# Altium schematic sheet S7CAS-PLEIADES-CARTE-MERE_Pxx_CAN.SchDoc
size Tabloid; SheetNumber: 12; SheetTotal: 18; Sheet_Name: CAN; Size: 11x17
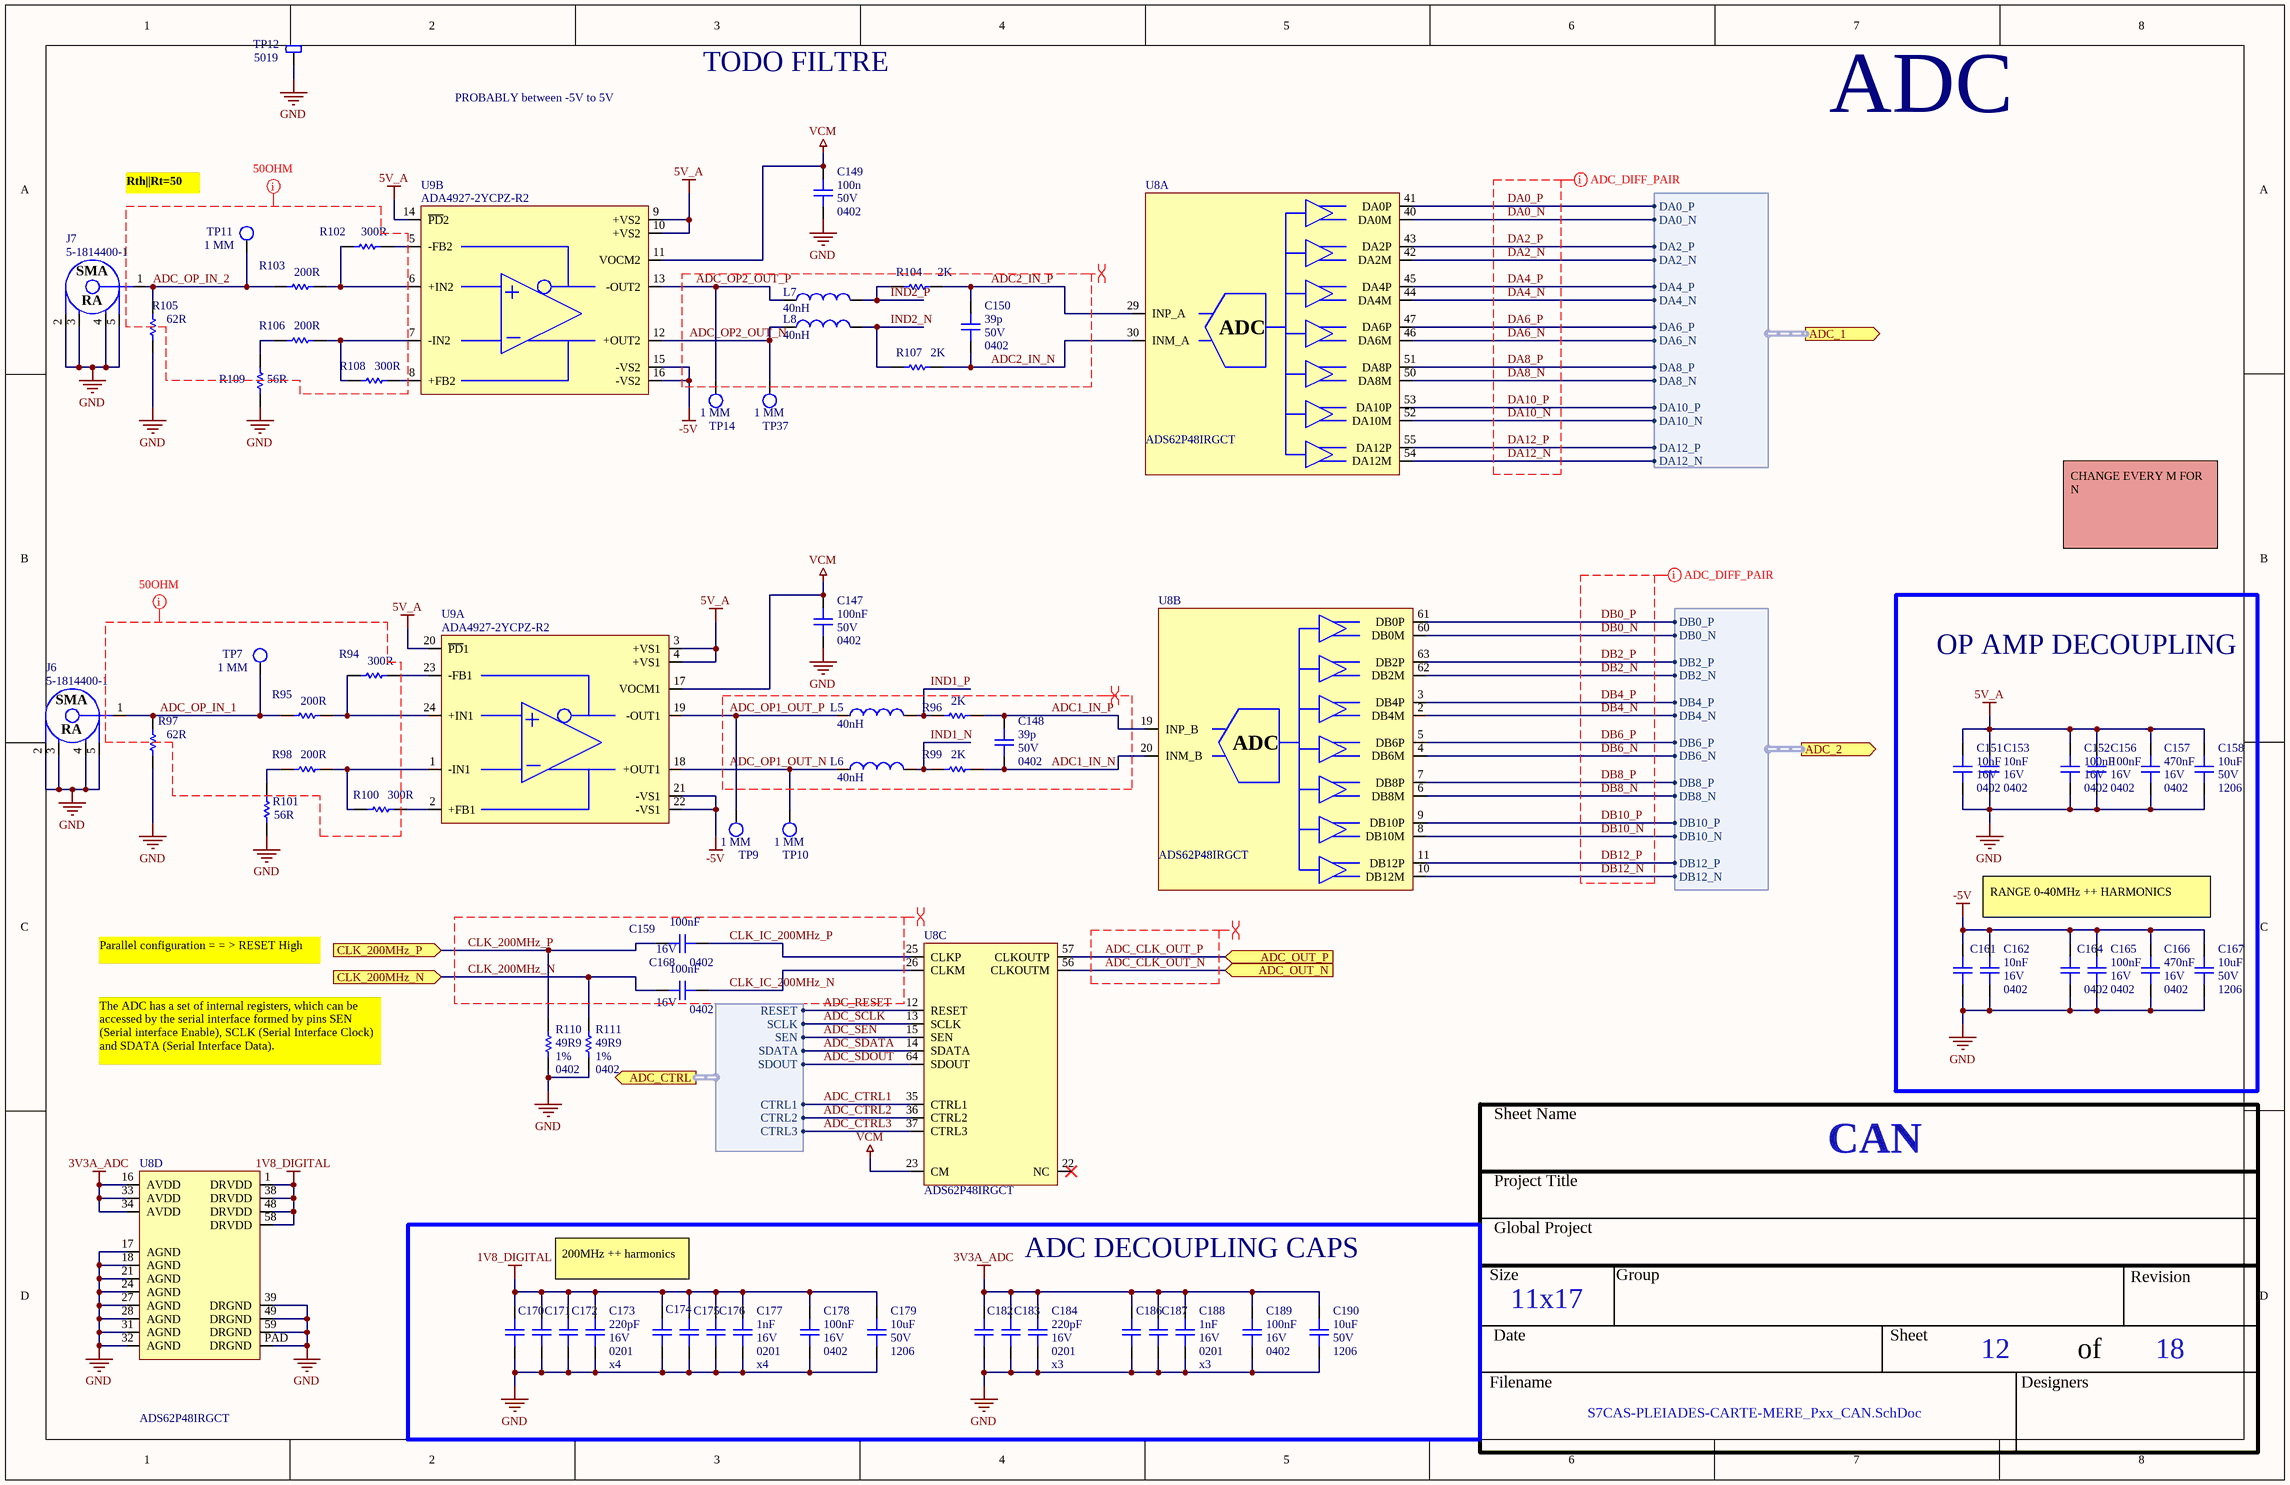
[diagram p0: S7CAS-PLEIADES-CARTE-MERE_Pxx_CAN.SchDoc]

## Parts
C147  value 100nF  Voltage: 50V  [CAP_0402]  (hidden comment: 0402)
C148  value 39p  Voltage: 50V  [CAP_0402]  (hidden comment: 0402)
C149  value 100n  Voltage: 50V  [CAP_0402]  (hidden comment: 0402)
C150  value 39p  Voltage: 50V  [CAP_0402]  (hidden comment: 0402)
C151  value 10nF  Voltage: 16V  Package: 0402  [CAP_0402]  (hidden comment: CAP - 0402)
C152  value 100nF  Voltage: 16V  [CAP_0402]  (hidden comment: 0402)
C153  value 10nF  Voltage: 16V  Package: 0402  [CAP_0402]  (hidden comment: CAP - 0402)
C156  value 100nF  Voltage: 16V  [CAP_0402]  (hidden comment: 0402)
C157  value 470nF  Voltage: 16V  [CAP_0402]  (hidden comment: 0402)
C158  value 10uF  Voltage: 50V  Package: 1206  [CAP_1206]  (hidden comment: CAP - 1206)
C159  value 100nF  Voltage: 16V  [CAP_0402]  (hidden comment: 0402)
C161  CAP - 0402  [CAP_0402]  (value not drawn)
C162  value 10nF  Voltage: 16V  Package: 0402  [CAP_0402]  (hidden comment: CAP - 0402)
C164  0402  [CAP_0402]
C165  value 100nF  Voltage: 16V  [CAP_0402]  (hidden comment: 0402)
C166  value 470nF  Voltage: 16V  [CAP_0402]  (hidden comment: 0402)
C167  value 10uF  Voltage: 50V  Package: 1206  [CAP_1206]  (hidden comment: CAP - 1206)
C168  value 100nF  Voltage: 16V  [CAP_0402]  (hidden comment: 0402)
C170  CAP - 0201  [CAP_0201]  (value not drawn)
C171  CAP - 0201  [CAP_0201]  (value not drawn)
C172  CAP - 0201  [CAP_0201]  (value not drawn)
C173  value 220pF  Voltage: 16V  Package: 0201  [CAP_0201]  (hidden comment: CAP - 0201)
C174  CAP - 0201  [CAP_0201]  (value not drawn)
C175  CAP - 0201  [CAP_0201]  (value not drawn)
C176  CAP - 0201  [CAP_0201]  (value not drawn)
C177  value 1nF  Voltage: 16V  Package: 0201  [CAP_0201]  (hidden comment: CAP - 0201)
C178  value 100nF  Voltage: 16V  [CAP_0402]  (hidden comment: 0402)
C179  value 10uF  Voltage: 50V  Package: 1206  [CAP_1206]  (hidden comment: CAP - 1206)
C182  CAP - 0201  [CAP_0201]  (value not drawn)
C183  CAP - 0201  [CAP_0201]  (value not drawn)
C184  value 220pF  Voltage: 16V  Package: 0201  [CAP_0201]  (hidden comment: CAP - 0201)
C186  CAP - 0201  [CAP_0201]  (value not drawn)
C187  CAP - 0201  [CAP_0201]  (value not drawn)
C188  value 1nF  Voltage: 16V  Package: 0201  [CAP_0201]  (hidden comment: CAP - 0201)
C189  value 100nF  Voltage: 16V  [CAP_0402]  (hidden comment: 0402)
C190  value 10uF  Voltage: 50V  Package: 1206  [CAP_1206]  (hidden comment: CAP - 1206)
J6  5-1814400-1  [CONN_SMA_5-1814400-1]
J7  5-1814400-1  [CONN_SMA_5-1814400-1]
L5  value 40nH  [IND - 0402]  (hidden comment: INDUCTOR - 0402)
L6  value 40nH  [IND - 0402]  (hidden comment: INDUCTOR - 0402)
L7  value 40nH  [IND - 0402]  (hidden comment: INDUCTOR - 0402)
L8  value 40nH  [IND - 0402]  (hidden comment: INDUCTOR - 0402)
R94  value 300R  [RES_0402]  (hidden comment: RES - 0603)
R95  value 200R  [RES_0402]  (hidden comment: RES - 0603)
R96  value 2K  [RES_0402]  (hidden comment: RES - 0603)
R97  value 62R  [RES_0402]  (hidden comment: RES - 0603)
R98  value 200R  [RES_0402]  (hidden comment: RES - 0603)
R99  value 2K  [RES_0402]  (hidden comment: RES - 0603)
R100  value 300R  [RES_0402]  (hidden comment: RES - 0603)
R101  value 56R  [RES_0402]  (hidden comment: RES - 0603)
R102  value 300R  [RES_0402]  (hidden comment: RES - 0603)
R103  value 200R  [RES_0402]  (hidden comment: RES - 0603)
R104  value 2K  [RES_0402]  (hidden comment: RES - 0603)
R105  value 62R  [RES_0402]  (hidden comment: RES - 0603)
R106  value 200R  [RES_0402]  (hidden comment: RES - 0603)
R107  value 2K  [RES_0402]  (hidden comment: RES - 0603)
R108  value 300R  [RES_0402]  (hidden comment: RES - 0603)
R109  value 56R  [RES_0402]  (hidden comment: RES - 0603)
R110  value 49R9  Package: 0402  Precision: 1%  [RES_0402]  (hidden comment: RES - 0603)
R111  value 49R9  Package: 0402  Precision: 1%  [RES_0402]  (hidden comment: RES - 0603)
TP7  1 MM  [TPO_SMD_ROUND_1MM]  (no BOM)
TP9  1 MM  [TPO_SMD_ROUND_1MM]  (no BOM)
TP10  1 MM  [TPO_SMD_ROUND_1MM]  (no BOM)
TP11  1 MM  [TPO_SMD_ROUND_1MM]  (no BOM)
TP12  5019  [TPO_SMD_5019]
TP14  1 MM  [TPO_SMD_ROUND_1MM]  (no BOM)
TP37  1 MM  [TPO_SMD_ROUND_1MM]  (no BOM)
U8  ADS62P48IRGCT  [ADC_ADS62P48IRGCT]  (parts A,B,C,D of 4)
U9  ADA4927-2YCPZ-R2  [OPAMP_ADA4927-2YCPZ-R2]  (parts A,B of 2)

## Blocks framed on the sheet
OP AMP DECOUPLING: C151-C153 C156-C158 C161 C162 C164-C167
ADC DECOUPLING CAPS: C170-C179 C182-C184 C186-C190

## Ports
ADC_1 (out, harness ADC_1_HARNESS, see S7CAS-PLEIADES-CARTE-MERE_Pxx_FPGA_bank3[1A]), ADC_2 (out, harness ADC_2_HARNESS, see S7CAS-PLEIADES-CARTE-MERE_Pxx_FPGA_bank3[1B]), ADC_CTRL (out, harness ADC_CTRL_HARNESS, see S7CAS-PLEIADES-CARTE-MERE_Pxx_FPGA_bank3[2C]), ADC_OUT_N (in, see S7CAS-PLEIADES-CARTE-MERE_Pxx_FPGA_bank3[5B]), ADC_OUT_P (in, see S7CAS-PLEIADES-CARTE-MERE_Pxx_FPGA_bank3[5B]), CLK_200MHz_N (in, see S7CAS-PLEIADES-CARTE-MERE_Pxx_FLASH_PHY_CLOCK[5A]), CLK_200MHz_P (in, see S7CAS-PLEIADES-CARTE-MERE_Pxx_FLASH_PHY_CLOCK[5A])

## Harnesses
ADC_1_HARNESS: DA0_P, DA0_N, DA2_P, DA2_N, DA4_P, DA4_N, DA6_P, DA6_N, DA8_P, DA8_N, DA10_P, DA10_N, DA12_P, DA12_N
ADC_2_HARNESS: DB0_P, DB0_N, DB2_P, DB2_N, DB4_P, DB4_N, DB6_P, DB6_N, DB8_P, DB8_N, DB10_P, DB10_N, DB12_P, DB12_N
ADC_CTRL_HARNESS: RESET, SCLK, SEN, SDATA, SDOUT, CTRL1, CTRL2, CTRL3

## Nets
1V8_DIGITAL: C170.2 C171.2 C172.2 C173.2 C174.2 C175.2 C176.2 C177.2 C178.2 C179.2 U8.1(DRVDD) U8.38(DRVDD) U8.48(DRVDD) U8.58(DRVDD)
3V3A_ADC: C182.2 C183.2 C184.2 C186.2 C187.2 C188.2 C189.2 C190.2 U8.16(AVDD) U8.33(AVDD) U8.34(AVDD)
5V_A: C151.2 C152.2 C153.2 C156.2 C157.2 C158.2 U9.3(+VS1) U9.4(+VS1) U9.9(+VS2) U9.10(+VS2) U9.14(~{PD}2) U9.20(~{PD}1)
-5V: C161.2 C162.2 C164.2 C165.2 C166.2 C167.2 U9.15(-VS2) U9.16(-VS2) U9.21(-VS1) U9.22(-VS1)
GND: C147.1 C149.1 C151.1 C152.1 C153.1 C156.1 C157.1 C158.1 C161.1 C162.1 C164.1 C165.1 C166.1 C167.1 C170.1 C171.1 C172.1 C173.1 C174.1 C175.1 C176.1 C177.1 C178.1 C179.1 C182.1 C183.1 C184.1 C186.1 C187.1 C188.1 C189.1 C190.1 J6.2 J6.3 J6.4 J6.5 J7.2 J7.3 J7.4 J7.5 R97.1 R101.2 R105.1 R109.2 R110.1 R111.1 TP12.1 U8.17(AGND) U8.18(AGND) U8.21(AGND) U8.24(AGND) U8.27(AGND) U8.28(AGND) U8.31(AGND) U8.32(AGND) U8.39(DRGND) U8.49(DRGND) U8.59(DRGND) U8.PAD(DRGND)
VCM: C147.2 C149.2 U8.23(CM) U9.11(VOCM2) U9.17(VOCM1)
ADC1_IN_N: C148.1 R99.1 U8.20(INM_B)
ADC1_IN_P: C148.2 R96.1 U8.19(INP_B)
ADC2_IN_N: C150.1 R107.1 U8.30(INM_A)
ADC2_IN_P: C150.2 R104.1 U8.29(INP_A)
ADC_CLK_OUT_N: U8.56(CLKOUTM) ; port ADC_OUT_N
ADC_CLK_OUT_P: U8.57(CLKOUTP) ; port ADC_OUT_P
ADC_CTRL1: U8.35(CTRL1) ; port ADC_CTRL.CTRL1
ADC_CTRL2: U8.36(CTRL2) ; port ADC_CTRL.CTRL2
ADC_CTRL3: U8.37(CTRL3) ; port ADC_CTRL.CTRL3
ADC_OP1_OUT_N: L6.1 TP10.1 U9.18(+OUT1)
ADC_OP1_OUT_P: L5.1 TP9.1 U9.19(-OUT1)
ADC_OP2_OUT_N: L8.1 TP37.1 U9.12(+OUT2)
ADC_OP2_OUT_P: L7.1 TP14.1 U9.13(-OUT2)
ADC_OP_IN_1: J6.1 R95.2 R97.2 TP7.1
ADC_OP_IN_2: J7.1 R103.2 R105.2 TP11.1
ADC_RESET: U8.12(RESET) ; port ADC_CTRL.RESET
ADC_SCLK: U8.13(SCLK) ; port ADC_CTRL.SCLK
ADC_SDATA: U8.14(SDATA) ; port ADC_CTRL.SDATA
ADC_SDOUT: U8.64(SDOUT) ; port ADC_CTRL.SDOUT
ADC_SEN: U8.15(SEN) ; port ADC_CTRL.SEN
CLK_200MHz_N: C168.2 R111.2 ; port CLK_200MHz_N
CLK_200MHz_P: C159.2 R110.2 ; port CLK_200MHz_P
CLK_IC_200MHz_N: C168.1 U8.26(CLKM)
CLK_IC_200MHz_P: C159.1 U8.25(CLKP)
DA0_N: U8.40(DA0M) ; port ADC_1.DA0_N
DA0_P: U8.41(DA0P) ; port ADC_1.DA0_P
DA2_N: U8.42(DA2M) ; port ADC_1.DA2_N
DA2_P: U8.43(DA2P) ; port ADC_1.DA2_P
DA4_N: U8.44(DA4M) ; port ADC_1.DA4_N
DA4_P: U8.45(DA4P) ; port ADC_1.DA4_P
DA6_N: U8.46(DA6M) ; port ADC_1.DA6_N
DA6_P: U8.47(DA6P) ; port ADC_1.DA6_P
DA8_N: U8.50(DA8M) ; port ADC_1.DA8_N
DA8_P: U8.51(DA8P) ; port ADC_1.DA8_P
DA10_N: U8.52(DA10M) ; port ADC_1.DA10_N
DA10_P: U8.53(DA10P) ; port ADC_1.DA10_P
DA12_N: U8.54(DA12M) ; port ADC_1.DA12_N
DA12_P: U8.55(DA12P) ; port ADC_1.DA12_P
DB0_N: U8.60(DB0M) ; port ADC_2.DB0_N
DB0_P: U8.61(DB0P) ; port ADC_2.DB0_P
DB2_N: U8.62(DB2M) ; port ADC_2.DB2_N
DB2_P: U8.63(DB2P) ; port ADC_2.DB2_P
DB4_N: U8.2(DB4M) ; port ADC_2.DB4_N
DB4_P: U8.3(DB4P) ; port ADC_2.DB4_P
DB6_N: U8.4(DB6M) ; port ADC_2.DB6_N
DB6_P: U8.5(DB6P) ; port ADC_2.DB6_P
DB8_N: U8.6(DB8M) ; port ADC_2.DB8_N
DB8_P: U8.7(DB8P) ; port ADC_2.DB8_P
DB10_N: U8.8(DB10M) ; port ADC_2.DB10_N
DB10_P: U8.9(DB10P) ; port ADC_2.DB10_P
DB12_N: U8.10(DB12M) ; port ADC_2.DB12_N
DB12_P: U8.11(DB12P) ; port ADC_2.DB12_P
IND1_N: L6.2 R99.2
IND1_P: L5.2 R96.2
IND2_N: L8.2 R107.2
IND2_P: L7.2 R104.2
NetR94_1: R94.1 U9.23(-FB1)
NetR94_2: R94.2 R95.1 U9.24(+IN1)
NetR98_1: R98.1 R100.2 U9.1(-IN1)
NetR98_2: R98.2 R101.1
NetR100_1: R100.1 U9.2(+FB1)
NetR102_1: R102.1 U9.5(-FB2)
NetR102_2: R102.2 R103.1 U9.6(+IN2)
NetR106_1: R106.1 R108.2 U9.7(-IN2)
NetR106_2: R106.2 R109.1
NetR108_1: R108.1 U9.8(+FB2)

Not connected (* = marked no-connect by the designer): U8 22(NC)*

## Layout directives
differential pair; differential pair class ADC_DATA_OUT; differential pair class LVDS: DA0_N, DA0_P, DA2_N, DA2_P, DA4_N, DA4_P, DA6_N, DA6_P, DA8_N, DA8_P, DA10_N, DA10_P, DA12_N, DA12_P, DB0_N, DB0_P, DB2_N, DB2_P, DB4_N, DB4_P, DB6_N, DB6_P, DB8_N, DB8_P, DB10_N, DB10_P, DB12_N, DB12_P
differential pair; differential pair class CLK_200MHz; differential pair class LVDS: CLK_200MHz_N, CLK_200MHz_P, CLK_IC_200MHz_N, CLK_IC_200MHz_P
differential pair; differential pair class ADC_REF_CLOCK; differential pair class LVDS: ADC_CLK_OUT_N, ADC_CLK_OUT_P
differential pair; differential pair class OP_AMP_DIFF_CLASS; differential pair class 100OHMDIFF: ADC1_IN_N, ADC1_IN_P, ADC2_IN_N, ADC2_IN_P, ADC_OP1_OUT_N, ADC_OP1_OUT_P, ADC_OP2_OUT_N, ADC_OP2_OUT_P, IND1_N, IND2_N, IND2_P
net class 50OHM: ADC_OP_IN_1, ADC_OP_IN_2

## Notes on the sheet
- TODO FILTRE
- PROBABLY between -5V to 5V
- ADC
- Rth||Rt=50
- CHANGE EVERY M FOR N
- Parallel configuration = = > RESET High
- RANGE 0-40MHz ++ HARMONICS
- The ADC has a set of internal registers, which can be accessed by the serial interface formed by pins SEN
  (Serial interface Enable), SCLK (Serial Interface Clock) and SDATA (Serial Interface Data).
- 200MHz ++ harmonics
- (near C173) x4
- (near C177) x4
- (near C184) x3
- (near C188) x3
- Sheet Name
- Project Title
- Global Project
- Size
- Group
- Revision
- Date
- Sheet
- of
- Filename
- Designers
- (in symbol ADC_ADS62P48IRGCT, part A) ADC
- (in symbol ADC_ADS62P48IRGCT, part B) ADC
- (in symbol CONN_SMA_5-1814400-1) SMA; RA

## Library data of the parts
C147-C150 C152 C156 C157 C159 C165 C166 C168 C178 C189 = CAP - 0603: CAP - 0402; Precision: 10%; Current: *; CreatedBy: Jonathan Bouchard; Power: *; Package: 0402
  C152 C156 C159 C165 C168 C178 C189: Supplier 1: Arrow Electronics; Supplier Part Number 1: CL10B104KO8NNNC
  C157 C166: Supplier 1: Arrow Electronics; Supplier Part Number 1: C1608X7R1C474K080AC
C151 C153 C162 = CAP - 0402: Precision: 10%; Current: *; CreatedBy: Jonathan Bouchard; Power: *; Supplier 1: Arrow Electronics; Supplier Part Number 1: GRM155R61A224KE19D
C158 C167 C179 C190 = CAP - 1206: Precision: 10%; Current: *; CreatedBy: Jonathan Bouchard; Power: *; Supplier 1: Avnet; Supplier Part Number 1: CL31A106MBHNNNE
C161 = CAP - 0402: Precision: 10%; Voltage: 16V; Value: 10nF; Current: *; CreatedBy: Jonathan Bouchard; Power: *; Package: 0402; Supplier 1: Arrow Electronics; Supplier Part Number 1: GRM155R61A224KE19D
C164 = CAP - 0603: CAP - 0402; Precision: 10%; Voltage: 16V; Value: 100nF; Current: *; CreatedBy: Jonathan Bouchard; Power: *; Package: 0402; Supplier 1: Arrow Electronics; Supplier Part Number 1: CL10B104KO8NNNC
C170-C172 C182 C183 = CAP - 0201: Precision: 10%; Voltage: 16V; Value: 220pF; Current: *; CreatedBy: Jonathan Bouchard; Power: *; Package: 0201; Supplier 1: Arrow Electronics; Supplier Part Number 1: GRM033R71C221KA01D
C173 C177 C184 C188 = CAP - 0201: Precision: 10%; Current: *; CreatedBy: Jonathan Bouchard; Power: *
  C173 C184: Supplier 1: Arrow Electronics; Supplier Part Number 1: GRM033R71C221KA01D
  C177 C188: Supplier 1: Avnet; Supplier Part Number 1: GRM033R71C102KA01J
C174-C176 C186 C187 = CAP - 0201: Precision: 10%; Voltage: 16V; Value: 1nF; Current: *; CreatedBy: Jonathan Bouchard; Power: *; Package: 0201; Supplier 1: Avnet; Supplier Part Number 1: GRM033R71C102KA01J
J6 J7 = CONN_SMA_5-1814400-1: CONN -  SMA JACK R/A 50 OHM - TH; Mfg: TE Connectivity AMP Connectors; Voltage: *; Current: *; Power: *; Mfg Part Number: 5-1814400-1; HelpURL: http://www.te.com/commerce/DocumentDelivery/DDEController?Action=srchrtrv&DocNm=1814400&DocType=Customer+Drawing&DocLang=English; CreatedBy: Jonathan Bouchard; Temperature: -55°C ~ 85°C; Value: *; Precision: *; Package: TH-5; Supplier 1: Digikey; Supplier Part Number 1: A97593-ND
L5-L8 = INDUCT - 0402: GRAMS Lib Spec: 2.7; Saturation Val: [SATURATION]; Supplier 1: Mouser; Supplier Part Number 1: 81-LQW15AN40NG00D
R94-R111 = RES - 0603: RES - 0402; Current: *; CreatedBy: Jonathan Bouchard
  R110 R111: Supplier 1: Mouser; Supplier Part Number 1: 667-ERJ-3EKF49R9V
TP7 TP9-TP11 TP14 TP37 = TPO_SMD_ROUND_1MM: TPO - TEST POINT ROUND SMD PAD ONLY  - 1 MM; Magnetic Material: NO; GRAMS Lib Spec: 2.8; Cryo: UNKNOWN; Current Rating: *; Manufacturer #1: *; Manufacturer #2: *; Note: *; Power Max: *; Value: *; Part Number #2: *; HelpURL: *; Polarized: *; Supplier 1: *; Supplier Part Number 1: *; Assembly Type: NONE; Part Number #1: *; Package: 1 MM ROUND; CreatedBy/Date: Jonathan Bouchard 2018-07-17; Temperature: *; Tolerance: *; VerifiedBy: Arnaud Samson 23-07-18; Voltage Rating: *
TP12 = TPO_SMD_5019: TPO - PC TEST POINT MINI - SMD; Manufacturer #1: Keystone Electronics; Value: 3.81mm x 2.03mm; Polarized: No; Magnetic Material: UNKNOWN; GRAMS Lib Spec: 2.8; Current Rating: *; Manufacturer #2: *; Note: *; Power Max: *; Part Number #2: *; HelpURL: https://www.digikey.ca/product-detail/en/keystone-electronics/5019/36-5019CT-ND/3907344; Supplier 1: Digi-Key; Supplier Part Number 1: 36-5019CT-ND; Assembly Type: SMD; Part Number #1: 5019; Package: SMD; CreatedBy/Date: Olivier Bernard / 5/12/2017; Temperature: *; Tolerance: *; VerifiedBy: Caroline Paulin / 5 juillet 2018; Voltage Rating: *; Cryo: UNKNOWN
U8 = ADC_ADS62P48IRGCT: ADC - 14 BIT 210MSPS SUAL - VQFN-64; Voltage: 3.15 V ~ 3.6 V / 1.7 V ~ 1.9 V; Mfg: Texas Instruments; Precision: 14 Bit; Current: *; Power: *; Mfg Part Number: ADS62P48IRGCT; HelpURL: http://www.ti.com/lit/ds/symlink/ads62p48.pdf; CreatedBy: Jonathan Bouchard; Temperature: -40°C ~ 85°C; Value: *; Package: VQFN-64; Supplier 1: Mouser; Supplier Part Number 1: 595-ADS62P48IRGCT
U9 = OPAMP_ADA4927-2YCPZ-R2: OPAMP - CFA 2.3GHZ - QFN-24; Voltage: 4.5 V ~ 11 V, ±2.25 V ~ 5.5 V; Current: 65mA; Mfg: Analog Devices; Power: *; Mfg Part Number: ADA4927-2YCPZ-R2; HelpURL: http://www.analog.com/media/en/technical-documentation/data-sheets/ADA4927-1_4927-2.pdf; CreatedBy: Jonathan Bouchard; Temperature: -40°C ~ 105°C; Value: *; Precision: *; Package: QFN-24; Supplier 1: Digikey; Supplier Part Number 1: ADA4927-2YCPZ-R2CT-ND